# Altium schematic sheet DD2090_4CAM_FFC_Power_Supply.SchDoc: =project_title
size Tabloid; PageSetup: Record=PageOptions|CenterHorizontal=True|CenterVertical=True|PrintScale=0.73|XCorrection=1.00|YCorrection=1.00|PrintKind=0|BorderSize=5000000|LeftOffset=0|BottomOffset=0|Orientation=2|PaperLength=1000|PaperWidth=1000|Scale=100|PaperSource=7|PrintQuality=-4|MediaType=1|DitherType=10|PaperKind=A4|PrintScaleMode=1; CompanyName: Luxonis Holding; DrawnBy: David Malovrh; Organization: Luxonis Holding; Address1: 1925 Harmony Park Drive; Address2: Westminster, CO; Address3: 80234; Address4: United States; SheetNumber: 10; SheetTotal: 12
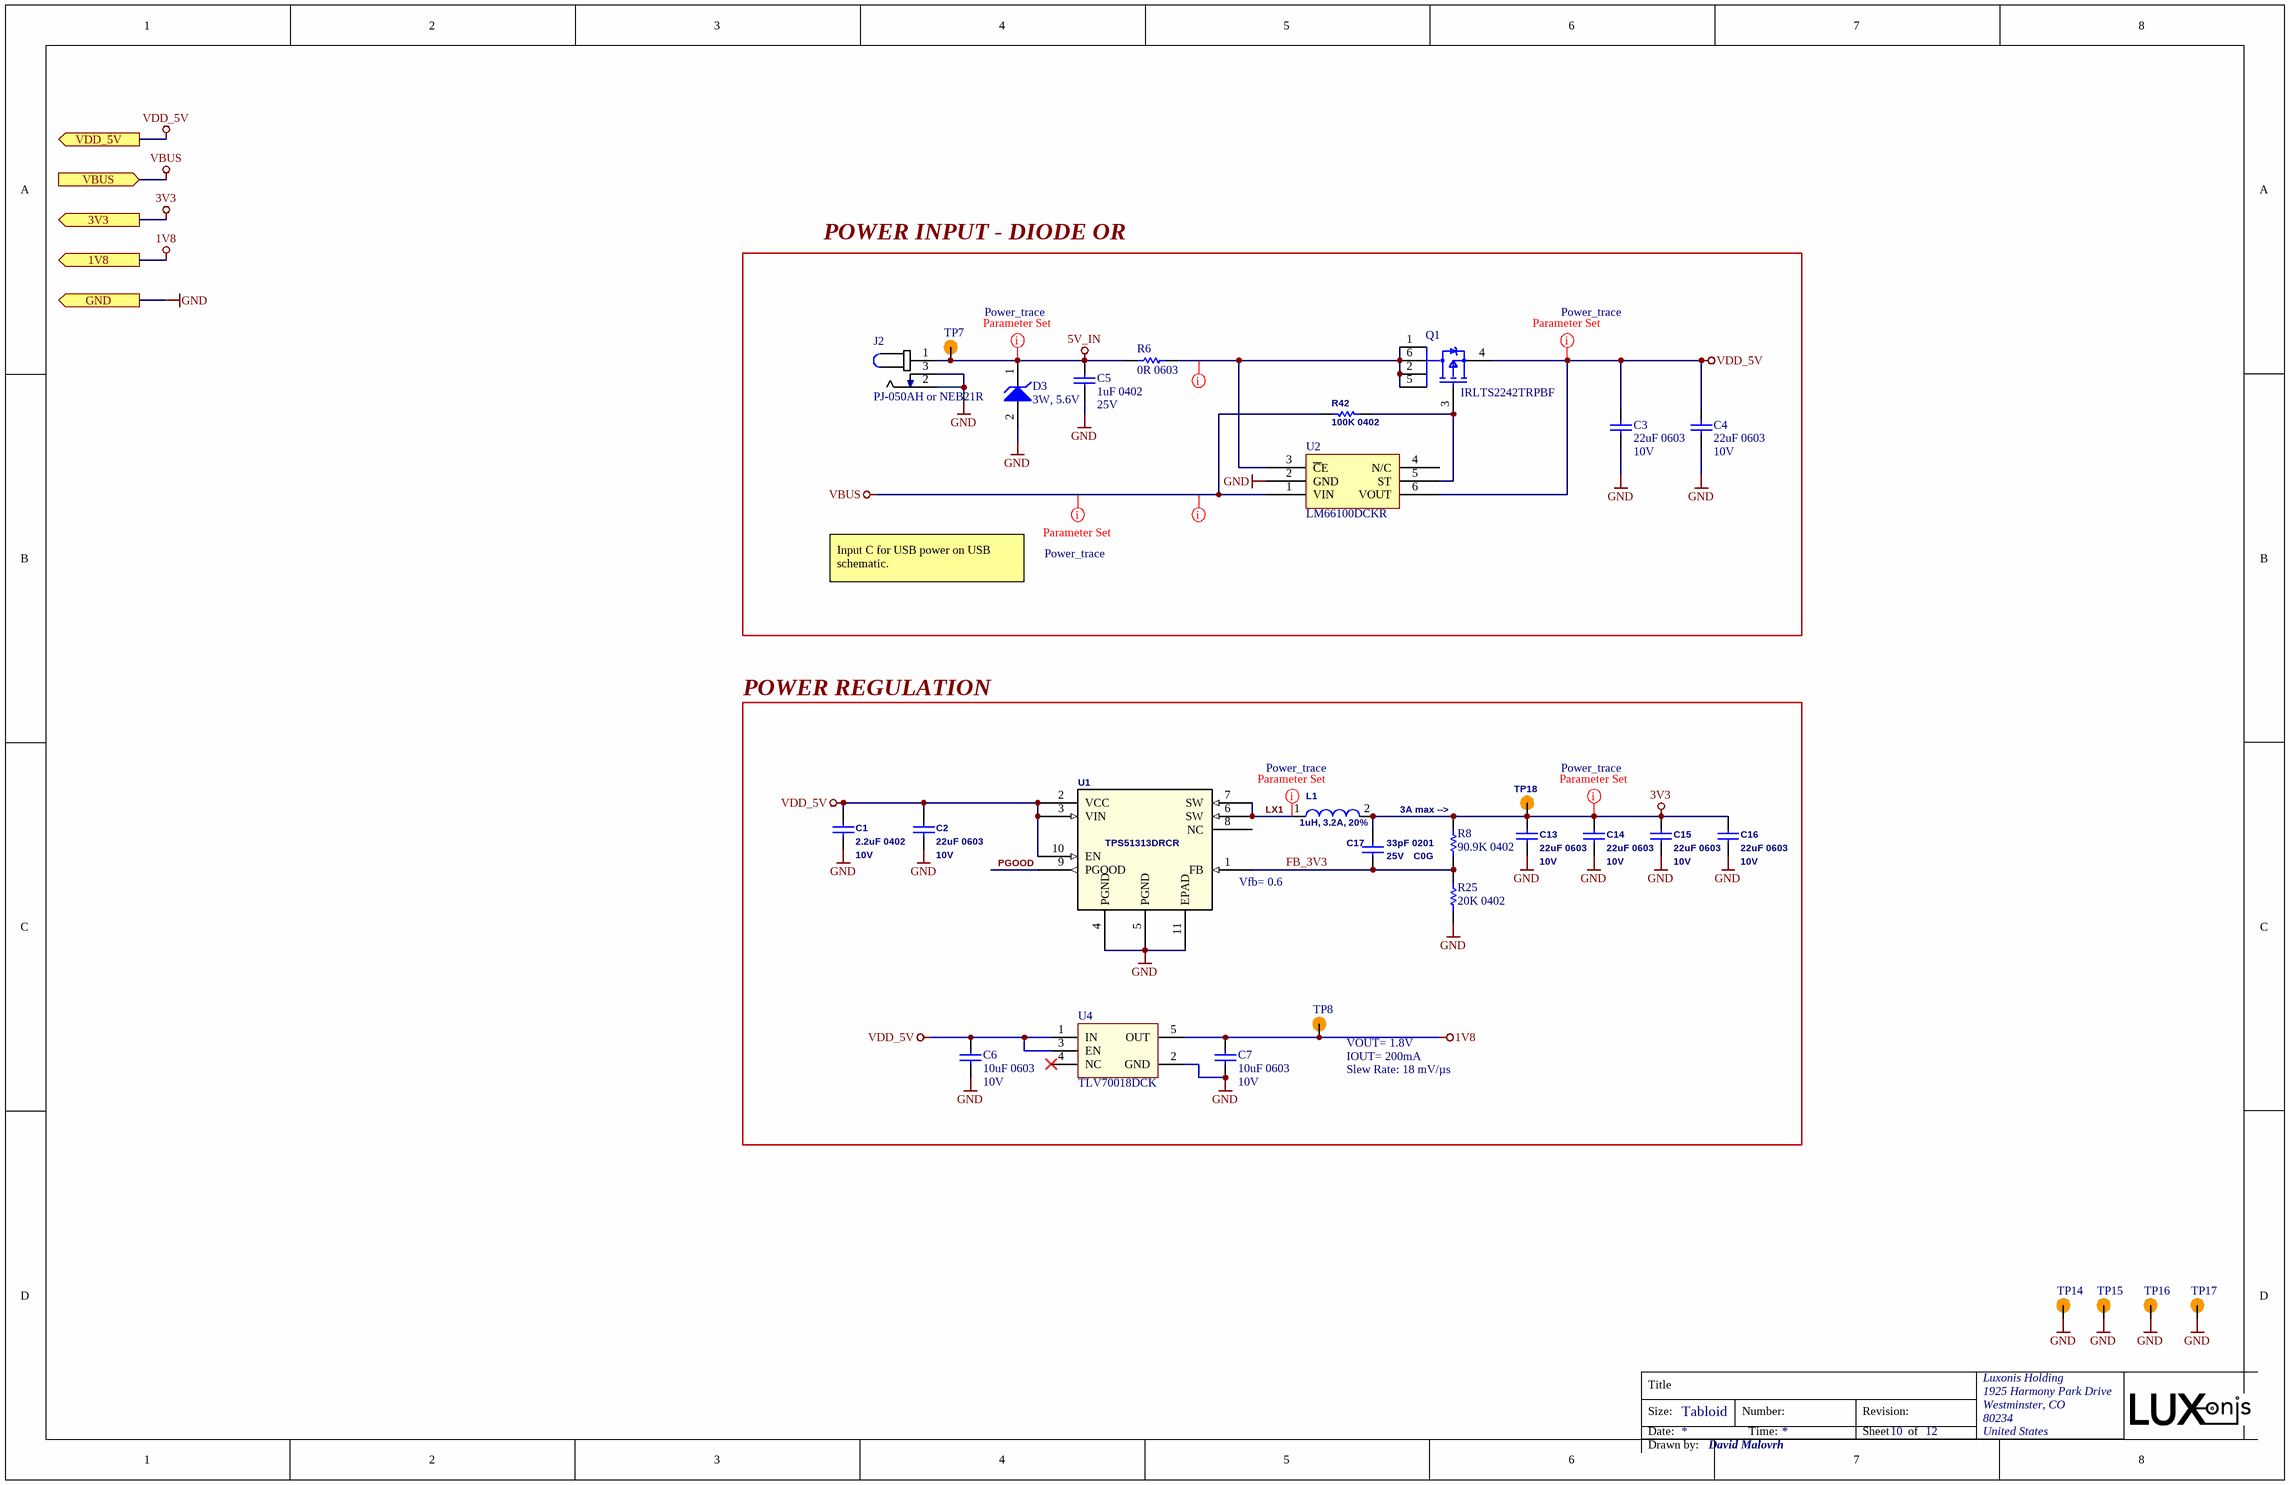
[diagram p0: DD2090_4CAM_FFC_Power_Supply.SchDoc]

## Parts
C1  2.2uF 0402  Voltage Rating: 10V  [CAPC0402(1005)70_L]
C2  22uF 0603  Voltage Rating: 10V  [CAPC0603(1608)100_L]
C3  22uF 0603  Voltage Rating: 10V  [CAPC0603(1608)100_N]
C4  22uF 0603  Voltage Rating: 10V  [CAPC0603(1608)100_N]
C5  1uF 0402  Voltage Rating: 25V  [CAPC0402(1005)70_N]
C6  10uF 0603  Voltage Rating: 10V  [CAPC0603(1608)100_L]
C7  10uF 0603  Voltage Rating: 10V  [CAPC0603(1608)100_L]
C13  22uF 0603  Voltage Rating: 10V  [CAPC0603(1608)100_L]
C14  22uF 0603  Voltage Rating: 10V  [CAPC0603(1608)100_L]
C15  22uF 0603  Voltage Rating: 10V  [CAPC0603(1608)100_L]
C16  22uF 0603  Voltage Rating: 10V  [CAPC0603(1608)100_L]
C17  33pF 0201  Voltage Rating: 25V  Dielectric: C0G  [CAPC0201(0603)33_L]
D3  3W, 5.6V  [1SMB5919BT3G]
J2  PJ-050AH or NEB21R  [PJ-050AH/NEB21R_COMBO]
L1  1uH, 3.2A, 20%  [DFE252012P-1R0M=P2]
Q1  IRLTS2242TRPBF  [TSOP-6-MFG]
R6  0R 0603  [RESC0603(1608)_N]
R8  90.9K 0402  [RESC0402(1005)_L]
R25  20K 0402  [RESC0402(1005)_L]
R42  100K 0402  [RESC0402(1005)_L]
TP7  TP100_200_NS  [TP100_200_NS]  (value not drawn)  (no BOM)
TP8  TP100_200_NS  [TP100_200_NS]  (value not drawn)  (no BOM)
TP14  TP100_200_NS  [TP100_200_NS]  (value not drawn)  (no BOM)
TP15  TP100_200_NS  [TP100_200_NS]  (value not drawn)  (no BOM)
TP16  TP100_200_NS  [TP100_200_NS]  (value not drawn)  (no BOM)
TP17  TP100_200_NS  [TP100_200_NS]  (value not drawn)  (no BOM)
TP18  TP075_150_NS  [TP075_150_NS]  (value not drawn)  (no BOM)
U1  TPS51313DRCR  [VSON-TPS51313DRCR]
U2  LM66100DCKR  [LM66100DCKR]
U4  TLV70018DCK  [TLV70018DCK]

## Blocks framed on the sheet
POWER INPUT - DIODE OR: C3-C5 D3 J2 Q1 R6 R42 TP7 U2
POWER REGULATION: C1 C2 C6 C7 C13-C17 L1 R8 R25 TP8 TP18 U1 U4

## Ports
1V8 (out), 3V3 (out), GND (out), VBUS (in), VDD_5V (out)

## Nets
1V8: C7.2 TP8.1 U4.5(OUT) ; port 1V8
3V3: C13.1 C14.1 C15.1 C16.1 C17.2 L1.2 R8.2 TP18.1 ; port 3V3
5V_IN: C5.2 D3.1(K) J2.1 R6.1 TP7.1
GND: C1.2 C2.2 C3.1 C4.1 C5.1 C6.1 C7.1 C13.2 C14.2 C15.2 C16.2 D3.2(A) J2.2 J2.3 R25.1 TP14.1 TP15.1 TP16.1 TP17.1 U1.4(PGND) U1.5(PGND) U1.11(EPAD) U2.2(GND) U4.2(GND) ; port GND
VBUS: R42.1 U2.1(VIN) ; port VBUS
VDD_5V: C1.1 C2.1 C3.2 C4.2 C6.2 Q1.4(S) U1.2(VCC) U1.3(VIN) U1.10(EN) U2.6(VOUT) U4.1(IN) U4.3(EN) ; port VDD_5V
FB_3V3: C17.1 R8.1 R25.2 U1.1(FB)
LX1: L1.1 U1.6(SW) U1.7(SW)
PGOOD: U1.9(PGOOD)
NetQ1_1: Q1.1(D) Q1.2(D) Q1.5(D) Q1.6(D) R6.2 U2.3(~{C}E)
NetQ1_3: Q1.3(G) R42.2 U2.5(ST)

Not connected (* = marked no-connect by the designer): U1 8(NC); U2 4(N/C); U4 4(NC)*

## Layout directives
net class Power_trace: 3V3, 5V_IN, LX1, VBUS, VDD_5V
net class POWER: NetQ1_1, VBUS

## Notes on the sheet
- Input C for USB power on USB schematic.
- (near R8) 3A max -->
- (near U1) Vfb= 0.6
- (near TP8) VOUT= 1.8V
- (near TP8) IOUT= 200mA
- (near TP8) Slew Rate: 18 mV/µs
- Title
- Size:
- Date:
- Tabloid
- Number:
- Time:
- Revision:
- Sheet
- of
- Drawn by:

## Library data of the parts
C1 = GRM155R61A225KE95D: CAP CER 2.2UF 10V X5R 0402 10%; Manufacturer 1: Murata; Material: Ceramic; Supplier 1: Digi-Key; Manufacturer Part Number 1: GRM155R61A225KE95D; Stock 1: 1453518; Pricing 1: 1=0.13000, 10=0.09000, 100=0.04250, 500=0.02982, 1000=0.02469, 2500=0.02298, 5000=0.02103 (USD); RoHS: Yes; Mount: Surface Mount; Case/Package: 0402; Weight: 0.000212oz; Case Code (Metric): 1005; Case Code (Imperial): 0402; Min Operating Temperature: -55°C; Max Operating Temperature: 85°C; Capacitance: 2.2uF; Tolerance: 10%; Packaging: Tape and Reel; Dielectric: X5R; Termination: SMD/SMT; Voltage Rating (DC): 10V; Package Quantity: 10000; Length: 1mm; Height: 0.5mm; Width: 0.5mm; Thickness: 0.022inch; Depth: 0.5mm; REACH SVHC: No SVHC; Lead Free: Lead Free; ComponentLink1URL: http://www.mouser.com/ds/2/281/c02e-2905.pdf?src-supplier=Mouser; ComponentLink1Description: http://www.mouser.com/ds/2/281/c02e-2905.pdf?src-supplier=Mouser; ComponentLink2URL: http://components.arrow.com/part/dataview/0323_04264073?src-supplier=Arrow+Europe; ComponentLink2Description: http://components.arrow.com/part/dataview/0323_04264073?src-supplier=Arrow+Europe; ComponentLink3URL: http://www.farnell.com/datasheets/1872202.pdf?src-supplier=Farnell; ComponentLink3Description: http://www.farnell.com/datasheets/1872202.pdf?src-supplier=Farnell; ComponentLink4URL: http://www.farnell.com/datasheets/2047915.pdf?src-supplier=Farnell; ComponentLink4Description: http://www.farnell.com/datasheets/2047915.pdf?src-supplier=Farnell; ComponentLink5URL: http://www.farnell.com/datasheets/1872202.pdf?src-supplier=Element14; ComponentLink5Description: http://www.farnell.com/datasheets/1872202.pdf?src-supplier=Element14; ComponentLink6URL: http://psearch.en.murata.com/capacitor/product/GRM155R61A225KE95%23.pdf?src-supplier=Avnet; ComponentLink6Description: http://psearch.en.murata.com/capacitor/product/GRM155R61A225KE95%23.pdf?src-supplier=Avnet; ComponentLink7URL: http://www.farnell.com/datasheets/2047915.pdf?src-supplier=Element14; ComponentLink7Description: http://www.farnell.com/datasheets/2047915.pdf?src-supplier=Element14; ComponentLink8URL: https://search.murata.co.jp/Ceramy/image/img/A01X/G101/ENG/GRM155R61A225KE95-01.pdf?src-supplier=Digi-Key; ComponentLink8Description: https://search.murata.co.jp/Ceramy/image/img/A01X/G101/ENG/GRM155R61A225KE95-01.pdf?src-supplier=Digi-Key; ComponentLink9URL: http://www.farnell.com/datasheets/2047915.pdf?src-supplier=Newark; ComponentLink9Description: http://www.farnell.com/datasheets/2047915.pdf?src-supplier=Newark; Supplier Part Number 1: 490-10451-1-ND
C2-C4 C13-C16 = GRM188R61A226ME15D: CAP CER 22UF 10V X5R 0603 20%; Manufacturer 1: Murata; Material: Ceramic; ComponentLink1URL: https://datasheet.ciiva.com/46444/1769893-46444975.pdf?src-supplier=Element14; ComponentLink1Description: https://datasheet.ciiva.com/46444/1769893-46444975.pdf?src-supplier=Element14; Supplier 1: Digi-Key; Manufacturer Part Number 1: GRM188R61A226ME15D; Stock 1: 984716; Pricing 1: 1=0.31000, 10=0.21500, 100=0.12160, 500=0.08584, 1000=0.07512 (USD); RoHS: Yes; Mount: Surface Mount; Case/Package: 0603; Weight: 0.000222oz; Case Code (Metric): 1608; Case Code (Imperial): 0603; Min Operating Temperature: -55°C; Max Operating Temperature: 85°C; Capacitance: 22uF; Tolerance: 20%; Packaging: Tape and Reel; Dielectric: X5R; Voltage Rating (DC): 10V; Termination: SMD/SMT; Package Quantity: 4000; Length: 1.6mm; Height: 0.8mm; Width: 0.8mm; Thickness: 0.039inch; Depth: 0.8mm; REACH SVHC: No SVHC; Lead Free: Lead Free; Supplier Part Number 1: 490-10476-1-ND
C5 = GRM155R61E105KA12D: CAP CER 1UF 25V X5R 0402 10%; Manufacturer 1: Murata; Material: Ceramic; Supplier 1: Digi-Key; Manufacturer Part Number 1: GRM155R61E105KA12D; Stock 1: 200653; Pricing 1: 1=0.10000, 10=0.07100, 100=0.03350, 500=0.02352, 1000=0.01947, 2500=0.01812, 5000=0.01658 (USD); RoHS: Yes; Mount: Surface Mount; Case/Package: 0402; Weight: 0.000212oz; Case Code (Metric): 1005; Case Code (Imperial): 0402; Min Operating Temperature: -55°C; Max Operating Temperature: 85°C; Tolerance: 10%; Capacitance: 1uF; Dielectric: X5R; Voltage Rating (DC): 25V; Packaging: Tape and Reel; Package Quantity: 10000; Termination: SMD/SMT; Voltage: 25V; Length: 1mm; Height: 0.5mm; Width: 0.5mm; Thickness: 0.022inch; Depth: 0.5mm; Lead Free: Lead Free; REACH SVHC: No SVHC; ComponentLink1URL: https://datasheet.ciiva.com/22732/1666664-22732122.pdf?src-supplier=Element14; ComponentLink1Description: https://datasheet.ciiva.com/22732/1666664-22732122.pdf?src-supplier=Element14; ComponentLink2URL: https://datasheet.ciiva.com/7719/1666664-7719006.pdf?src-supplier=Element14; ComponentLink2Description: https://datasheet.ciiva.com/7719/1666664-7719006.pdf?src-supplier=Element14; Supplier Part Number 1: 490-10017-1-ND
C6 C7 = GRM188R61A106ME69D: CAP CER 10UF 10V X5R 0603 20%; Manufacturer 1: Murata; Material: Ceramic; Supplier 1: Digi-Key; Manufacturer Part Number 1: GRM188R61A106ME69D; Stock 1: 2873098; Pricing 1: 1=0.21000, 10=0.14100, 100=0.07130, 500=0.04876, 1000=0.04313 (USD); RoHS: Yes; Mount: Surface Mount; Case/Package: 0603; Weight: 0.000222oz; Case Code (Metric): 1608; Case Code (Imperial): 0603; Min Operating Temperature: -55°C; Max Operating Temperature: 85°C; Packaging: Tape and Reel; Tolerance: 20%; Capacitance: 10uF; Dielectric: X5R; Voltage Rating (DC): 10V; Package Quantity: 4000; Termination: SMD/SMT; Length: 1.6mm; Height: 0.8mm; Width: 0.8mm; Thickness: 0.035inch; Depth: 0.8mm; REACH SVHC: Unknown; Lead Free: Lead Free; ComponentLink1URL: http://www.mouser.com/ds/2/281/c02e-2905.pdf?src-supplier=Mouser; ComponentLink1Description: http://www.mouser.com/ds/2/281/c02e-2905.pdf?src-supplier=Mouser; ComponentLink2URL: http://components.arrow.com/part/dataview/0323_06119472?src-supplier=Arrow+Europe; ComponentLink2Description: http://components.arrow.com/part/dataview/0323_06119472?src-supplier=Arrow+Europe; ComponentLink3URL: http://www.farnell.com/datasheets/2048014.pdf?src-supplier=Farnell; ComponentLink3Description: http://www.farnell.com/datasheets/2048014.pdf?src-supplier=Farnell; ComponentLink4URL: http://www.farnell.com/datasheets/1872210.pdf?src-supplier=Farnell; ComponentLink4Description: http://www.farnell.com/datasheets/1872210.pdf?src-supplier=Farnell; ComponentLink5URL: http://search.murata.co.jp/Ceramy/image/img/A01X/G101/ENG/GRM188R61A106ME69-01.pdf?src-supplier=Digi-Key; ComponentLink5Description: http://search.murata.co.jp/Ceramy/image/img/A01X/G101/ENG/GRM188R61A106ME69-01.pdf?src-supplier=Digi-Key; ComponentLink6URL: http://www.farnell.com/datasheets/1872210.pdf?src-supplier=Newark; ComponentLink6Description: http://www.farnell.com/datasheets/1872210.pdf?src-supplier=Newark; ComponentLink7URL: http://www.farnell.com/datasheets/2048014.pdf?src-supplier=Element14; ComponentLink7Description: http://www.farnell.com/datasheets/2048014.pdf?src-supplier=Element14; ComponentLink8URL: http://www.farnell.com/datasheets/2048014.pdf?src-supplier=Newark; ComponentLink8Description: http://www.farnell.com/datasheets/2048014.pdf?src-supplier=Newark; Supplier Part Number 1: 490-10475-1-ND
C17 = GRM0335C1E330JA01D: CAP CER 33PF 25V C0G/NP0 0201; Manufacturer 1: Murata; Tolerance: 5%; Supplier 1: Digi-Key; Manufacturer Part Number 1: GRM0335C1E330JA01D; Stock 1: 1107200; Pricing 1: 1=0.10000, 10=0.01500, 100=0.00680, 500=0.00484, 1000=0.00380, 2500=0.00345, 5000=0.00317 (USD); RoHS: Yes; Mount: Surface Mount; Case/Package: 0201; Case Code (Metric): 0603; Case Code (Imperial): 0201; Min Operating Temperature: -55°C; Max Operating Temperature: 125°C; Capacitance: 33pF; Packaging: Tape and Reel; Package Quantity: 15000; Voltage Rating (DC): 25V; Termination: SMD/SMT; Length: 0.6mm; Height: 0.3mm; Width: 0.012inch; Thickness: 0.013inch; Depth: 0.3mm; REACH SVHC: No SVHC; Lead Free: Lead Free; ComponentLink1URL: https://datasheet.ciiva.com/29538/partnumbering-e-01-29538933.pdf?src-supplier=Digi-Key; ComponentLink1Description: https://datasheet.ciiva.com/29538/partnumbering-e-01-29538933.pdf?src-supplier=Digi-Key; Supplier 2: Mouser; Supplier Part Number 2: 81-GRM0335C1E330JA1D; Supplier Part Number 1: 490-10678-1-ND
D3 = 1SMB5919BT3G: DIODE ZENER 5.6V 3W SMB; Manufacturer 1: ON Semiconductor; Material: Plastic; Tolerance: 5%; Max Reverse Leakage Current: 5uA; Impedance: 2R; Element Configuration: Single; Forward Voltage: 1.5V; Power Dissipation: 550mW; Zener Current: 267mA; Test Current: 66.9mA; Breakdown Voltage: 5.88V; ESD Protection: Yes; Supplier 1: Digi-Key; Manufacturer Part Number 1: 1SMB5919BT3G; RoHS: Yes; Category: Zener Diodes; Stock 1: 59012; Pricing 1: 2500=0.08908, 5000=0.08384, 12500=0.07860, 25000=0.07598, 62500=0.07074 (USD); Case/Package: SMB; Number of Pins: 2; Contact Plating: Tin,Matte; Min Operating Temperature: -65°C; Max Operating Temperature: 150°C; Package Quantity: 1; Packaging: Tape and Reel; Max Power Dissipation: 3W; Voltage Tolerance: 5%; Zener Voltage: 5.6V; Working Voltage: 5.6V; Peak Reverse Current: 5uA; Voltage Rating (DC): 5.6V; Power Rating: 3W; Length: 4.32mm; Height: 2.13mm; Width: 3.56mm; Radiation Hardening: No; Lead Free: Lead Free; Halogen Free: Halogen Free; REACH SVHC: No SVHC; ComponentLink1URL: https://datasheet.ciiva.com/27747/1308331-27747654.pdf?src-supplier=Jameco; ComponentLink1Description: https://datasheet.ciiva.com/27747/1308331-27747654.pdf?src-supplier=Jameco; ComponentLink2URL: https://datasheet.ciiva.com/1182/1smb5913bt3-d-1182657.pdf?src-supplier=Element14; ComponentLink2Description: https://datasheet.ciiva.com/1182/1smb5913bt3-d-1182657.pdf?src-supplier=Element14; ComponentLink3URL: https://datasheet.ciiva.com/1182/1smb5913bt3-d-1182658.pdf?src-supplier=Element14; ComponentLink3Description: https://datasheet.ciiva.com/1182/1smb5913bt3-d-1182658.pdf?src-supplier=Element14; ComponentLink4URL: https://datasheet.ciiva.com/895/1smb5913bt3-d-895203.pdf?src-supplier=Digi-Key; ComponentLink4Description: https://datasheet.ciiva.com/895/1smb5913bt3-d-895203.pdf?src-supplier=Digi-Key; ComponentLink5URL: https://datasheet.ciiva.com/895/1smb5913bt3-d-895204.pdf?src-supplier=Digi-Key; ComponentLink5Description: https://datasheet.ciiva.com/895/1smb5913bt3-d-895204.pdf?src-supplier=Digi-Key; ComponentLink6URL: https://datasheet.ciiva.com/895/1smb5913bt3-d-895205.pdf?src-supplier=Digi-Key; ComponentLink6Description: https://datasheet.ciiva.com/895/1smb5913bt3-d-895205.pdf?src-supplier=Digi-Key; ComponentLink7URL: https://datasheet.ciiva.com/15198/getdatasheetpartid-311040-15198695.pdf?src-supplier=Verical; ComponentLink7Description: https://datasheet.ciiva.com/15198/getdatasheetpartid-311040-15198695.pdf?src-supplier=Verical; ComponentLink8URL: https://datasheet.ciiva.com/16311/1smb5913bt3-d-16311847.pdf?src-supplier=Future+Electronics; ComponentLink8Description: https://datasheet.ciiva.com/16311/1smb5913bt3-d-16311847.pdf?src-supplier=Future+Electronics; ComponentLink9URL: https://datasheet.ciiva.com/16472/1smb5913bt3-d-16472779.pdf?src-supplier=Avnet+Asia; ComponentLink9Description: https://datasheet.ciiva.com/16472/1smb5913bt3-d-16472779.pdf?src-supplier=Avnet+Asia; Supplier 2: Avnet; Supplier 3: Newark; Supplier 4: LCSC; Supplier 5: Avnet Europe; Supplier Part Number 1: 1SMB5919BT3GOSTR-ND; Supplier Part Number 3: 67R1406; Supplier Part Number 4: C70260; Supplier Part Number 5: 1SMB5919BT3G; Supplier Part Number 2: 1SMB5919BT3G
J2 = PJ-050AH/NEB21R_COMBO: CONN POWER PIN 2 POS RA PTH Barrel jack 2.1mm x 5.5mm combo footprint; Manufacturer 1: CUI; Gender: Male; Shielding: Unshielded; Current Rating: 5A; Voltage Rating: 24V; Insulation Resistance: 100MR; Number of Conductors: 2; Max Current Rating: 3A; Voltage Rating (DC): 12V; Number of Ports: 1; Inside Diameter: 6mm; Supplier 1: Mouser; Manufacturer Part Number 1: PJ-050AH; Stock 1: 2665; Pricing 1: 1=0.78000, 10=0.68800, 50=0.62100, 100=0.59400, 1000=0.43200, 10000=0.39100 (USD); Mount: Through Hole; Color: Black; Contact Material: Copper; Contact Plating: Nickel; Housing Color: Black; Housing Material: Thermoplastic; Min Operating Temperature: -25°C; Max Operating Temperature: 85°C; Package Quantity: 500; Termination: Solder; Connector Type: Jack; Contact Gender: Male; Orientation: Horizontal; Lead Free: Lead Free; Flammability Rating: UL94 V-0; ComponentLink1URL: http://www.mouser.com/ds/2/670/PJ-050AH-524150.pdf?src-supplier=Mouser; ComponentLink1Description: http://www.mouser.com/ds/2/670/PJ-050AH-524150.pdf?src-supplier=Mouser; ComponentLink2URL: https://www.cui.com/product/resource/digikeypdf/pj-050ah.pdf?src-supplier=Digi-Key; ComponentLink2Description: https://www.cui.com/product/resource/digikeypdf/pj-050ah.pdf?src-supplier=Digi-Key; ComponentLink3URL: http://datasheet.octopart.com/PJ-050AH-CUI-datasheet-15696426.pdf?src-supplier=CUI; ComponentLink3Description: http://datasheet.octopart.com/PJ-050AH-CUI-datasheet-15696426.pdf?src-supplier=CUI; ComponentLink4URL: http://datasheet.octopart.com/PJ-050AH-CUI-datasheet-62089837.pdf?src-supplier=CUI; ComponentLink4Description: http://datasheet.octopart.com/PJ-050AH-CUI-datasheet-62089837.pdf?src-supplier=CUI; ComponentLink5URL: http://datasheet.octopart.com/PJ-050AH-CUI-datasheet-65972796.pdf?src-supplier=CUI; ComponentLink5Description: http://datasheet.octopart.com/PJ-050AH-CUI-datasheet-65972796.pdf?src-supplier=CUI; ComponentLink6URL: http://datasheet.octopart.com/PJ-050AH-CUI-datasheet-103766550.pdf?src-supplier=CUI; ComponentLink6Description: http://datasheet.octopart.com/PJ-050AH-CUI-datasheet-103766550.pdf?src-supplier=CUI; ComponentLink7URL: http://datasheet.octopart.com/PJ-050AH-CUI-datasheet-103111417.pdf?src-supplier=Electro+Sonic; ComponentLink7Description: http://datasheet.octopart.com/PJ-050AH-CUI-datasheet-103111417.pdf?src-supplier=Electro+Sonic; ComponentLink8URL: http://datasheet.octopart.com/PJ-050AH-CUI-datasheet-34390405.pdf?src-supplier=Future+Electronics; ComponentLink8Description: http://datasheet.octopart.com/PJ-050AH-CUI-datasheet-34390405.pdf?src-supplier=Future+Electronics; ComponentLink9URL: http://datasheet.octopart.com/PJ-050AH-CUI-datasheet-62073522.pdf?src-supplier=Future+Electronics; ComponentLink9Description: http://datasheet.octopart.com/PJ-050AH-CUI-datasheet-62073522.pdf?src-supplier=Future+Electronics; ComponentLink10URL: http://datasheet.octopart.com/PJ-050AH-CUI-datasheet-102985732.pdf?src-supplier=Future+Electronics; ComponentLink10Description: http://datasheet.octopart.com/PJ-050AH-CUI-datasheet-102985732.pdf?src-supplier=Future+Electronics; Supplier 2: Newark; Manufacturer 2: Lumberg; Manufacturer Part Number 2: NEB 21 R; Stock 2: 56; Pricing 2: 1=0.86400, 25=0.82100, 50=0.78300, 100=0.72900, 250=0.68600 (USD); Number of Pins: 2; Number of Terminals: 3; Packaging: Bulk; Max Voltage Rating (DC): 12V; Voltage Rating (AC): 12V; Length: 9mm; Depth: 14.5mm; REACH SVHC: No SVHC; ComponentLink11URL: https://datasheet.ciiva.com/11720/0900766b805694d6-11720273.pdf?src-supplier=RSComponents; ComponentLink11Description: https://datasheet.ciiva.com/11720/0900766b805694d6-11720273.pdf?src-supplier=RSComponents; ComponentLink12URL: https://datasheet.ciiva.com/1115/28897-1115898.pdf?src-supplier=Newark; ComponentLink12Description: https://datasheet.ciiva.com/1115/28897-1115898.pdf?src-supplier=Newark; ComponentLink13URL: https://datasheet.ciiva.com/8066/1700582-8066298.pdf?src-supplier=Element14; ComponentLink13Description: https://datasheet.ciiva.com/8066/1700582-8066298.pdf?src-supplier=Element14; ComponentLink14URL: https://datasheet.ciiva.com/29365/738882-da-01-ml-netzger-einbaukuppl-neb-21-r-de-en-fr-29365351.pdf?src-supplier=Conrad; ComponentLink14Description: https://datasheet.ciiva.com/29365/738882-da-01-ml-netzger-einbaukuppl-neb-21-r-de-en-fr-29365351.pdf?src-supplier=Conrad; ComponentLink15URL: http://datasheet.octopart.com/NEB-21-R-Lumberg-datasheet-15206778.pdf?src-supplier=Newark; ComponentLink15Description: http://datasheet.octopart.com/NEB-21-R-Lumberg-datasheet-15206778.pdf?src-supplier=Newark; ComponentLink16URL: http://datasheet.octopart.com/NEB-21-R-Lumberg-datasheet-103789672.pdf?src-supplier=Farnell; ComponentLink16Description: http://datasheet.octopart.com/NEB-21-R-Lumberg-datasheet-103789672.pdf?src-supplier=Farnell; ComponentLink17URL: http://datasheet.octopart.com/NEB-21-R-Lumberg-datasheet-136395310.pdf?src-supplier=Toby+Electronics; ComponentLink17Description: http://datasheet.octopart.com/NEB-21-R-Lumberg-datasheet-136395310.pdf?src-supplier=Toby+Electronics; Supplier Part Number 1: 490-PJ-050AH; Supplier Part Number 2: 97K6458; Supplier 3: Digi-Key; Supplier Part Number 3: CP-050AH-ND; Supplier 4: Element14; Supplier Part Number 4: 1217037
L1 = DFE252012P-1R0M=P2: FIXED IND 1UH 3.2A 42 MOHM SMD; Manufacturer: Murata; Core Material: Ferrite; Current Rating: 4.3A; Shielding: Shielded; Test Frequency: 1MHz; DC Resistance (DCR): 42mR; Manufacturer Part Number: DFE252012P-1R0M=P2; RoHS: Yes; Mount: Surface Mount; Case/Package: 1008; Case Code (Metric): 2520; Min Operating Temperature: -40°C; Max Operating Temperature: 125°C; Packaging: Tape and Reel; Composition: Wirewound; Length: 0.098inch; Width: 0.079inch; Height - Seated (Max): 0.039inch; Depth: 2mm; ComponentLink1URL: http://www.farnell.com/datasheets/2550134.pdf?src-supplier=Farnell; ComponentLink1Description: http://www.farnell.com/datasheets/2550134.pdf?src-supplier=Farnell; ComponentLink2URL: https://www.murata.com/~/media/webrenewal/products/inductor/chip/tokoproducts/wirewoundmetalalloychiptype/m_dfe252012p.ashx?src-supplier=Digi-Key; ComponentLink2Description: https://www.murata.com/~/media/webrenewal/products/inductor/chip/tokoproducts/wirewoundmetalalloychiptype/m_dfe252012p.ashx?src-supplier=Digi-Key; ComponentLink3URL: http://www.murata.com/~/media/webrenewal/products/inductor/chip/tokoproducts/wirewoundmetalalloychiptype/m_dfe252012p.ashx?src-supplier=Digi-Key; ComponentLink3Description: http://www.murata.com/~/media/webrenewal/products/inductor/chip/tokoproducts/wirewoundmetalalloychiptype/m_dfe252012p.ashx?src-supplier=Digi-Key; ComponentLink4URL: http://www.toko.co.jp/products/pdf/inductors/dfe252012p.pdf?src-supplier=Avnet; ComponentLink4Description: http://www.toko.co.jp/products/pdf/inductors/dfe252012p.pdf?src-supplier=Avnet; Supplier 1: Digi-Key; Manufacturer 1: Murata; Manufacturer Part Number 1: DFE252012P-1R0M=P2; Stock 1: 2560; Pricing 1: 1=0.43000, 10=0.37800, 100=0.27030, 500=0.22702, 1000=0.18377 (USD); Supplier Part Number 1: 490-10647-1-ND; Max DC Current: 3.2A; Tolerance: 20%; Case Code (Imperial): 1008; Supplier 2: Digi-Key; Manufacturer 2: Murata; Manufacturer Part Number 2: DFE252012P-1R0M=P2; Stock 2: 95; Pricing 2: 1=0.43000, 10=0.37800, 100=0.27030, 500=0.22702, 1000=0.18377 (USD); Supplier 3: Mouser; Manufacturer 3: Murata; Manufacturer Part Number 3: DFE252012P-1R0M=P2; Stock 3: 667; Pricing 3: 1=0.43000, 10=0.37900, 50=0.37900, 100=0.27000, 1000=0.18400, 10000=0.14600 (USD); Supplier 4: Element14; Manufacturer 4: Murata; Manufacturer Part Number 4: DFE252012P-1R0M=P2; Stock 4: 41; Pricing 4: 1=0.64000, 10=0.56500, 100=0.40500, 500=0.34000, 1000=0.27500 (SGD); Supplier Part Number 4: 2530071; Supplier Part Number 3: 81-DFE252012P-1R0MP2; Supplier Part Number 2: 490-10647-6-ND; Inductance: 1uH
Q1 = CMP-016-000020-1: MOSFET P-CH 20V 6.9A 6TSOP; Manufacturer 1: Infineon; Drain to Source Voltage (Vdss): -20V; Rise Time: 18ns; Max Power Dissipation: 2W; Gate to Source Voltage (Vgs): 12V; Input Capacitance: 905pF; Rds On Max: 32mR; Threshold Voltage: -400mV; Mount: Surface Mount; Min Operating Temperature: -55°C; Source: LuxonisMaster.SchLib; Halogen Free: Halogen Free; Lead Free: Lead Free; Contact Plating: Tin; Case/Package: TSOP; Number of Pins: 6; Manufacturer Part Number 1: IRLTS2242TRPBF; Design Item ID: IRLTS2242TRPBF; Max Operating Temperature: 150°C; Packaging: Tape and Reel; Continuous Drain Current (ID): 6.9A; REACH SVHC: No SVHC; Max Dual Supply Voltage: -20V; RoHS Compliant: Yes
R6 = CRCW06030000Z0EA: RES SMD 0 OHM JUMPER 1/10W 0603 0 Ohms Jumper 0.1W, 1/10W Chip Resistor 0603 (1608 Metric) Automotive AEC-Q200 Thick Film; Manufacturer 1: Vishay; Manufacturer Part Number 1: CRCW0603-0000Z0EA; Resistance: 0mR; Power Rating: 100mW; Voltage Rating: 75V; Temperature Coefficient: 100ppm/°C; Tolerance: 5%; Current Rating: 2A; Supplier 1: Digi-Key; Stock 1: 742743; Pricing 1: 1=0.100000, 10=0.034000, 25=0.024400, 50=0.018600, 100=0.013800, 250=0.010480, 500=0.008400, 1000=0.006180 (USD); RoHS: Yes; Mount: Surface Mount; Case/Package: 0603; Weight: 7.1E-05oz; Contact Plating: Tin,Lead; Case Code (Metric): 1608; Case Code (Imperial): 0603; Min Operating Temperature: -55°C; Max Operating Temperature: 155°C; Composition: Thick Film; Termination: SMD/SMT; Packaging: Tape and Reel; Package Quantity: 1; Number of Terminations: 2; Military Standard: Not; Max Power Dissipation: 100mW; Voltage Rating (DC): 75V; Features: Automotive AEC-Q200; Working Voltage: 75V; Length: 1.55mm; Height: 0.02inch; Width: 0.033inch; Depth: 0.85mm; Radiation Hardening: No; Lead Free: Lead Free; REACH SVHC: Unknown; ComponentLink1URL: https://datasheet.ciiva.com/2461/dcrcwe3-2461968.pdf?src-supplier=Digi-Key; ComponentLink1Description: https://datasheet.ciiva.com/2461/dcrcwe3-2461968.pdf?src-supplier=Digi-Key; ComponentLink2URL: https://datasheet.ciiva.com/2461/dcrcwe3-2461969.pdf?src-supplier=Digi-Key; ComponentLink2Description: https://datasheet.ciiva.com/2461/dcrcwe3-2461969.pdf?src-supplier=Digi-Key; ComponentLink3URL: https://datasheet.ciiva.com/2461/dcrcwe3-2461970.pdf?src-supplier=Digi-Key; ComponentLink3Description: https://datasheet.ciiva.com/2461/dcrcwe3-2461970.pdf?src-supplier=Digi-Key; ComponentLink4URL: https://datasheet.ciiva.com/8340/dcrcwe3-8340197.pdf?src-supplier=Avnet; ComponentLink4Description: https://datasheet.ciiva.com/8340/dcrcwe3-8340197.pdf?src-supplier=Avnet; ComponentLink5URL: https://datasheet.ciiva.com/16941/dcrcw-16941302.pdf?src-supplier=Avnet+Europe; ComponentLink5Description: https://datasheet.ciiva.com/16941/dcrcw-16941302.pdf?src-supplier=Avnet+Europe; ComponentLink6URL: https://datasheet.ciiva.com/16199/dcrcwe3-16199063.pdf?src-supplier=Future+Electronics; ComponentLink6Description: https://datasheet.ciiva.com/16199/dcrcwe3-16199063.pdf?src-supplier=Future+Electronics; ComponentLink7URL: https://datasheet.ciiva.com/16725/70201119-16725175.pdf?src-supplier=Allied+Electronics; ComponentLink7Description: https://datasheet.ciiva.com/16725/70201119-16725175.pdf?src-supplier=Allied+Electronics; ComponentLink8URL: https://datasheet.ciiva.com/26316/fld-crcw-e3-data-en-26316615.pdf?src-supplier=Distrelec; ComponentLink8Description: https://datasheet.ciiva.com/26316/fld-crcw-e3-data-en-26316615.pdf?src-supplier=Distrelec; ComponentLink9URL: https://datasheet.ciiva.com/5544/dcrcwe3-109170-5544344.pdf?src-supplier=Mouser; ComponentLink9Description: https://datasheet.ciiva.com/5544/dcrcwe3-109170-5544344.pdf?src-supplier=Mouser; ComponentLink10URL: https://datasheet.ciiva.com/7841/1720486-7841816.pdf?src-supplier=Element14; ComponentLink10Description: https://datasheet.ciiva.com/7841/1720486-7841816.pdf?src-supplier=Element14; ComponentLink11URL: https://datasheet.ciiva.com/7841/1720486-7841817.pdf?src-supplier=Element14; ComponentLink11Description: https://datasheet.ciiva.com/7841/1720486-7841817.pdf?src-supplier=Element14; ComponentLink12URL: https://datasheet.ciiva.com/7841/125364-7841818.pdf?src-supplier=Element14; ComponentLink12Description: https://datasheet.ciiva.com/7841/125364-7841818.pdf?src-supplier=Element14; ComponentLink13URL: https://datasheet.ciiva.com/16721/70201119-16721450.pdf?src-supplier=Allied+Electronics; ComponentLink13Description: https://datasheet.ciiva.com/16721/70201119-16721450.pdf?src-supplier=Allied+Electronics; Supplier Part Number 1: 541-0.0GCT-ND
R8 = CRCW040290K9FKED: RES SMD 90.9K OHM 1% 1/16W 0402; Manufacturer 1: Vishay; Rated Power Dissipation (P): 63mW; Resistance: 90.9kR; Temperature Coefficient: 100ppm/°C; Working Voltage: 50V; Rated Temperature: 70°C; Package Height: 0.35mm; Package Length: 1mm; Package Width: 0.5mm; Reference Standard: AEC-Q200; Supplier 1: RSComponents; Manufacturer Part Number 1: CRCW040290K9FKED; RoHS: Yes; Category: Chip SMD Resistors; Stock 1: 1; Pricing 1: 50=0,05200, 250=0,04800, 500=0,04500, 1000=0,04300, 2500=0,03900 (USD); Mount: Surface Mount; Number of Pins: 2; Size Code: 0402; Terminal Finish: Nickel; Package Shape: Rectangular; Min Operating Temperature: -55°C; Max Operating Temperature: 155°C; Tolerance: 1%; JESD-609 Code: e3; Resistor Type: FIXED RESISTOR; Construction: Chip; Package Style: SMTMeter; Packaging: Tape and Reel; Technology: METAL GLAZE/THICK FILM; Termination: Wraparound; REACH SVHC: Yes; RoHS Compliant: Yes; ComponentLink1URL: https://datasheet.ciiva.com:443/pdfs/VipMasterIC/IC/VISH/VISH-S-A0007266705/VISH-S-A0007266705-1.pdf?src-supplier=IHS+Markit; ComponentLink1Description: https://datasheet.ciiva.com:443/pdfs/VipMasterIC/IC/VISH/VISH-S-A0007266705/VISH-S-A0007266705-1.pdf?src-supplier=IHS+Markit; ComponentLink2URL: https://datasheet.ciiva.com/11809/0900766b80d98824-11809982.pdf?src-supplier=RSComponents; ComponentLink2Description: https://datasheet.ciiva.com/11809/0900766b80d98824-11809982.pdf?src-supplier=RSComponents; ComponentLink3URL: https://datasheet.ciiva.com/2463/dcrcwe3-2463792.pdf?src-supplier=Digi-Key; ComponentLink3Description: https://datasheet.ciiva.com/2463/dcrcwe3-2463792.pdf?src-supplier=Digi-Key; ComponentLink4URL: https://datasheet.ciiva.com/16763/70201119-16763494.pdf?src-supplier=Allied+Electronics; ComponentLink4Description: https://datasheet.ciiva.com/16763/70201119-16763494.pdf?src-supplier=Allied+Electronics; ComponentLink5URL: https://datasheet.ciiva.com/5919/1697337-5919063.pdf?src-supplier=Farnell; ComponentLink5Description: https://datasheet.ciiva.com/5919/1697337-5919063.pdf?src-supplier=Farnell; ComponentLink6URL: https://datasheet.ciiva.com/7816/1697337-7816027.pdf?src-supplier=Element14; ComponentLink6Description: https://datasheet.ciiva.com/7816/1697337-7816027.pdf?src-supplier=Element14; ComponentLink7URL: https://datasheet.ciiva.com/7743/125364-7743772.pdf?src-supplier=Element14; ComponentLink7Description: https://datasheet.ciiva.com/7743/125364-7743772.pdf?src-supplier=Element14; ComponentLink8URL: https://datasheet.ciiva.com/7816/1697337-7816028.pdf?src-supplier=Element14; ComponentLink8Description: https://datasheet.ciiva.com/7816/1697337-7816028.pdf?src-supplier=Element14; ComponentLink9URL: https://datasheet.ciiva.com/2463/dcrcwe3-2463790.pdf?src-supplier=Digi-Key; ComponentLink9Description: https://datasheet.ciiva.com/2463/dcrcwe3-2463790.pdf?src-supplier=Digi-Key; ComponentLink10URL: https://datasheet.ciiva.com/5548/dcrcwe3-109170-5548606.pdf?src-supplier=Mouser; ComponentLink10Description: https://datasheet.ciiva.com/5548/dcrcwe3-109170-5548606.pdf?src-supplier=Mouser; ComponentLink11URL: https://datasheet.ciiva.com/2463/dcrcwe3-2463791.pdf?src-supplier=Digi-Key; ComponentLink11Description: https://datasheet.ciiva.com/2463/dcrcwe3-2463791.pdf?src-supplier=Digi-Key; ComponentLink12URL: https://datasheet.ciiva.com/3256/dcrcwe3-3256879.pdf?src-supplier=Avnet; ComponentLink12Description: https://datasheet.ciiva.com/3256/dcrcwe3-3256879.pdf?src-supplier=Avnet; Supplier Part Number 1: 6789639
R25 = RC0402FR-0720KL: RES SMD 20K OHM 1% 1/16W 0402 20 kOhms ±1% 0.063W, 1/16W Chip Resistor 0402 (1005 Metric) Moisture Resistant Thick Film; Manufacturer: Yageo; Resistance: 20kR; Temperature Coefficient: 100ppm/°C; Power Rating: 62.5mW; Voltage Rating: 50V; Max Power Dissipation: 63mW; Manufacturer Part Number: RC0402FR-0720KL; RoHS: Yes; Case/Package: 0402; Number of Pins: 2; Case Code (Metric): 1005; Case Code (Imperial): 0402; Min Operating Temperature: -55°C; Max Operating Temperature: 155°C; Tolerance: 1%; Packaging: Tape and Reel; Composition: Thick Film; Military Standard: Not; Number of Terminations: 2; Package Quantity: 1; Voltage Rating (DC): 50V; Termination: SMD/SMT; Features: Moisture Resistant; Length: 1mm; Height: 0.016inch; Width: 0.02inch; Depth: 0.5mm; Lead Free: Lead Free; REACH SVHC: No SVHC; ComponentLink1URL: https://datasheet.ciiva.com/11808/0900766b80c66297-11808454.pdf?src-supplier=RSComponents; ComponentLink1Description: https://datasheet.ciiva.com/11808/0900766b80c66297-11808454.pdf?src-supplier=RSComponents; ComponentLink2URL: https://datasheet.ciiva.com/2453/pyu-r-int-thick-7-2453493.pdf?src-supplier=Digi-Key; ComponentLink2Description: https://datasheet.ciiva.com/2453/pyu-r-int-thick-7-2453493.pdf?src-supplier=Digi-Key; ComponentLink3URL: https://datasheet.ciiva.com/2453/pyu-r-int-thick-7-2453494.pdf?src-supplier=Digi-Key; ComponentLink3Description: https://datasheet.ciiva.com/2453/pyu-r-int-thick-7-2453494.pdf?src-supplier=Digi-Key; ComponentLink4URL: https://datasheet.ciiva.com/2453/pyu-r-int-thick-7-2453495.pdf?src-supplier=Digi-Key; ComponentLink4Description: https://datasheet.ciiva.com/2453/pyu-r-int-thick-7-2453495.pdf?src-supplier=Digi-Key; ComponentLink5URL: https://datasheet.ciiva.com/7983/1018594-7983511.pdf?src-supplier=Element14; ComponentLink5Description: https://datasheet.ciiva.com/7983/1018594-7983511.pdf?src-supplier=Element14; ComponentLink6URL: https://datasheet.ciiva.com/12558/pyu-rc0402-51-rohs-l-6-r-8721-12558796.pdf?src-supplier=Mouser; ComponentLink6Description: https://datasheet.ciiva.com/12558/pyu-rc0402-51-rohs-l-6-r-8721-12558796.pdf?src-supplier=Mouser; ComponentLink7URL: https://datasheet.ciiva.com/46394/1018594-46394974.pdf?src-supplier=Element14; ComponentLink7Description: https://datasheet.ciiva.com/46394/1018594-46394974.pdf?src-supplier=Element14; Supplier 1: Digi-Key; Manufacturer 1: Yageo; Manufacturer Part Number 1: RC0402FR-0720KL; Stock 1: 5326062; Pricing 1: 1=0.10000, 10=0.01600, 100=0.00670, 1000=0.00301, 2500=0.00261, 5000=0.00215 (USD); Supplier Part Number 1: 311-20.0KLRCT-ND
R42 = RC0402FR-07100KL: RES SMD 100K OHM 1% 1/16W 0402; Manufacturer 1: Yageo; Power Rating: 63mW; Resistance: 100kR; Temperature Coefficient: 100ppm/°C; Voltage Rating: 50V; Supplier 1: Digi-Key; Manufacturer Part Number 1: RC0402FR-07100KL; Stock 1: 50867324; Pricing 1: 1=0.10000, 10=0.01500, 100=0.00600, 1000=0.00270, 2500=0.00235, 5000=0.00194 (USD); RoHS: Yes; Case/Package: 0402; Case Code (Metric): 1005; Case Code (Imperial): 0402; Min Operating Temperature: -55°C; Max Operating Temperature: 155°C; Tolerance: 1%; Packaging: Tape and Reel; Composition: Thick Film; Termination: SMD/SMT; Military Standard: Not; Package Quantity: 1; Number of Terminations: 2; Max Power Dissipation: 63mW; Features: Moisture Resistant; Working Voltage: 50V; Length: 0.039inch; Height: 0.016inch; Width: 0.02inch; Depth: 0.5mm; Lead Free: Lead Free; REACH SVHC: No SVHC; ComponentLink1URL: https://datasheet.ciiva.com/11819/0900766b80c66297-11819452.pdf?src-supplier=RSComponents; ComponentLink1Description: https://datasheet.ciiva.com/11819/0900766b80c66297-11819452.pdf?src-supplier=RSComponents; ComponentLink2URL: https://datasheet.ciiva.com/2453/pyu-r-int-thick-7-2453361.pdf?src-supplier=Digi-Key; ComponentLink2Description: https://datasheet.ciiva.com/2453/pyu-r-int-thick-7-2453361.pdf?src-supplier=Digi-Key; ComponentLink3URL: https://datasheet.ciiva.com/2453/pyu-r-int-thick-7-2453362.pdf?src-supplier=Digi-Key; ComponentLink3Description: https://datasheet.ciiva.com/2453/pyu-r-int-thick-7-2453362.pdf?src-supplier=Digi-Key; ComponentLink4URL: https://datasheet.ciiva.com/2453/pyu-r-int-thick-7-2453363.pdf?src-supplier=Digi-Key; ComponentLink4Description: https://datasheet.ciiva.com/2453/pyu-r-int-thick-7-2453363.pdf?src-supplier=Digi-Key; ComponentLink5URL: https://datasheet.ciiva.com/22747/1018594-22747509.pdf?src-supplier=Element14; ComponentLink5Description: https://datasheet.ciiva.com/22747/1018594-22747509.pdf?src-supplier=Element14; ComponentLink6URL: https://datasheet.ciiva.com/15189/getdatasheetpartid-323696-15189334.pdf?src-supplier=Verical; ComponentLink6Description: https://datasheet.ciiva.com/15189/getdatasheetpartid-323696-15189334.pdf?src-supplier=Verical; ComponentLink7URL: https://datasheet.ciiva.com/12667/pyu-rc0402-51-rohs-l-6-r-12667930.pdf?src-supplier=Mouser; ComponentLink7Description: https://datasheet.ciiva.com/12667/pyu-rc0402-51-rohs-l-6-r-12667930.pdf?src-supplier=Mouser; Supplier 2: Newark; Supplier 3: Mouser; Supplier Part Number 1: 311-100KLRCT-ND; Supplier Part Number 2: 67R9887; Supplier Part Number 3: 603-RC0402FR-07100KL
TP7 TP8 TP14-TP18 = TEST_POINT
  TP18: REACH SVHC: No SVHC; RoHS: Yes
U1 = TPS51313DRCR: Switching Regulator, Voltage-mode, 3A, 1000kHz Switching Freq-Max, PDSO10; Manufacturer 1: Texas Instruments; Manufacturer Part Number 1: TPS51313DRCT; Supplier 1: Digi-Key; RoHS: Yes; Category: Voltage Regulators - Switching; Stock 1: 10; Pricing 1: 1=4,35000, 10=3,90500, 25=3,69200, 100=3,19970 (USD); ComponentLink1URL: https://www.ti.com:443/lit/ds/symlink/tps51313.pdf?src-supplier=IHS+Markit; ComponentLink1Description: https://www.ti.com:443/lit/ds/symlink/tps51313.pdf?src-supplier=IHS+Markit; ComponentLink2URL: https://datasheet.ciiva.com/6606/tps51313-6606037.pdf?src-supplier=Digi-Key; ComponentLink2Description: https://datasheet.ciiva.com/6606/tps51313-6606037.pdf?src-supplier=Digi-Key; ComponentLink3URL: https://datasheet.ciiva.com/12221/slusb31-213375-12221240.pdf?src-supplier=Mouser; ComponentLink3Description: https://datasheet.ciiva.com/12221/slusb31-213375-12221240.pdf?src-supplier=Mouser; Supplier Part Number 1: 296-39625-1-ND
U2 = CMP-099-000001-1: IC OR CTRLR IDEAL DIODE SC70-6; Manufacturer 1: Texas Instruments; RoHS: No; Pricing 1: 1=0.41000, 10=0.32900, 25=0.30120, 100=0.20300, 250=0.16800, 500=0.15400, 1000=0.11550 (USD); Stock 1: 8042; Design Item ID: LM66100DCKR; Source: NG2391C-HM.SchLib; Category: Integrated Circuits (ICs); Manufacturer Part Number 1: LM66100DCKR
U4 = TLV70018DCK: IC REG LINEAR 1.8V 200MA SC70-5 Linear Voltage Regulator IC  1 Output  200mA SC-70-5; Manufacturer 1: Texas Instruments; Manufacturer Part Number 1: TLV70018DCKR; Max Power Dissipation: 320mW; Number of Outputs: 1; Dropout Voltage: 175mV; Max Input Voltage: 5.5V; Min Input Voltage: 2V; Min Current Limit: 220mA; Polarity: Positive; Output Voltage Accuracy: 2%; Quiescent Current: 30uA; Output Type: Fixed; Nominal Supply Current: 31uA; Supplier 1: Digi-Key; Stock 1: 63905; Pricing 1: 1=0.48000, 10=0.40900, 100=0.30570, 500=0.24020, 1000=0.18561 (USD); RoHS: Yes; Case/Package: SC; Number of Pins: 5; Contact Plating: Gold; Min Operating Temperature: -40°C; Max Operating Temperature: 125°C; Packaging: Tape and Reel; Package Quantity: 1; Output Voltage: 1.8V; Output Current: 200mA; Max Output Current: 200mA; Number of Regulators: 1; Power Dissipation: 320mW; Nominal Output Voltage: 1.8V; Accuracy: 2%; Max Output Voltage: 1.8V; Min Output Voltage: 1.8V; REACH SVHC: No SVHC; Lead Free: Lead Free; ComponentLink1URL: https://datasheet.ciiva.com/41462/001014631-da-01-en-ic-reg-ldo-1-8v-0-tlv70018dckr-sot-5-tid-41462480.pdf?src-supplier=Conrad; ComponentLink1Description: https://datasheet.ciiva.com/41462/001014631-da-01-en-ic-reg-ldo-1-8v-0-tlv70018dckr-sot-5-tid-41462480.pdf?src-supplier=Conrad; Supplier 2: Digi-Key; Manufacturer 2: Texas Instruments; Manufacturer Part Number 2: TLV70018DCKT; Stock 2: 13188; Pricing 2: 1=0.55000, 10=0.46700, 100=0.34900 (USD); Power Rating: 320mW; Length: 2.15mm; Height: 1mm; Width: 1.4mm; Radiation Hardening: No; ComponentLink2URL: https://datasheet.ciiva.com/22700/1882059-22700171.pdf?src-supplier=Element14; ComponentLink2Description: https://datasheet.ciiva.com/22700/1882059-22700171.pdf?src-supplier=Element14; ComponentLink3URL: https://datasheet.ciiva.com/14149/tlv700-eng-ds-14149837.pdf?src-supplier=Distrelec; ComponentLink3Description: https://datasheet.ciiva.com/14149/tlv700-eng-ds-14149837.pdf?src-supplier=Distrelec; ComponentLink4URL: https://datasheet.ciiva.com/7992/1882059-7992894.pdf?src-supplier=Element14; ComponentLink4Description: https://datasheet.ciiva.com/7992/1882059-7992894.pdf?src-supplier=Element14; Supplier Part Number 1: 296-32409-1-ND; Supplier Part Number 2: 296-25269-1-ND